# EAGLE schematic Sensor-amplification_V3 (EAGLE 7.4.0)
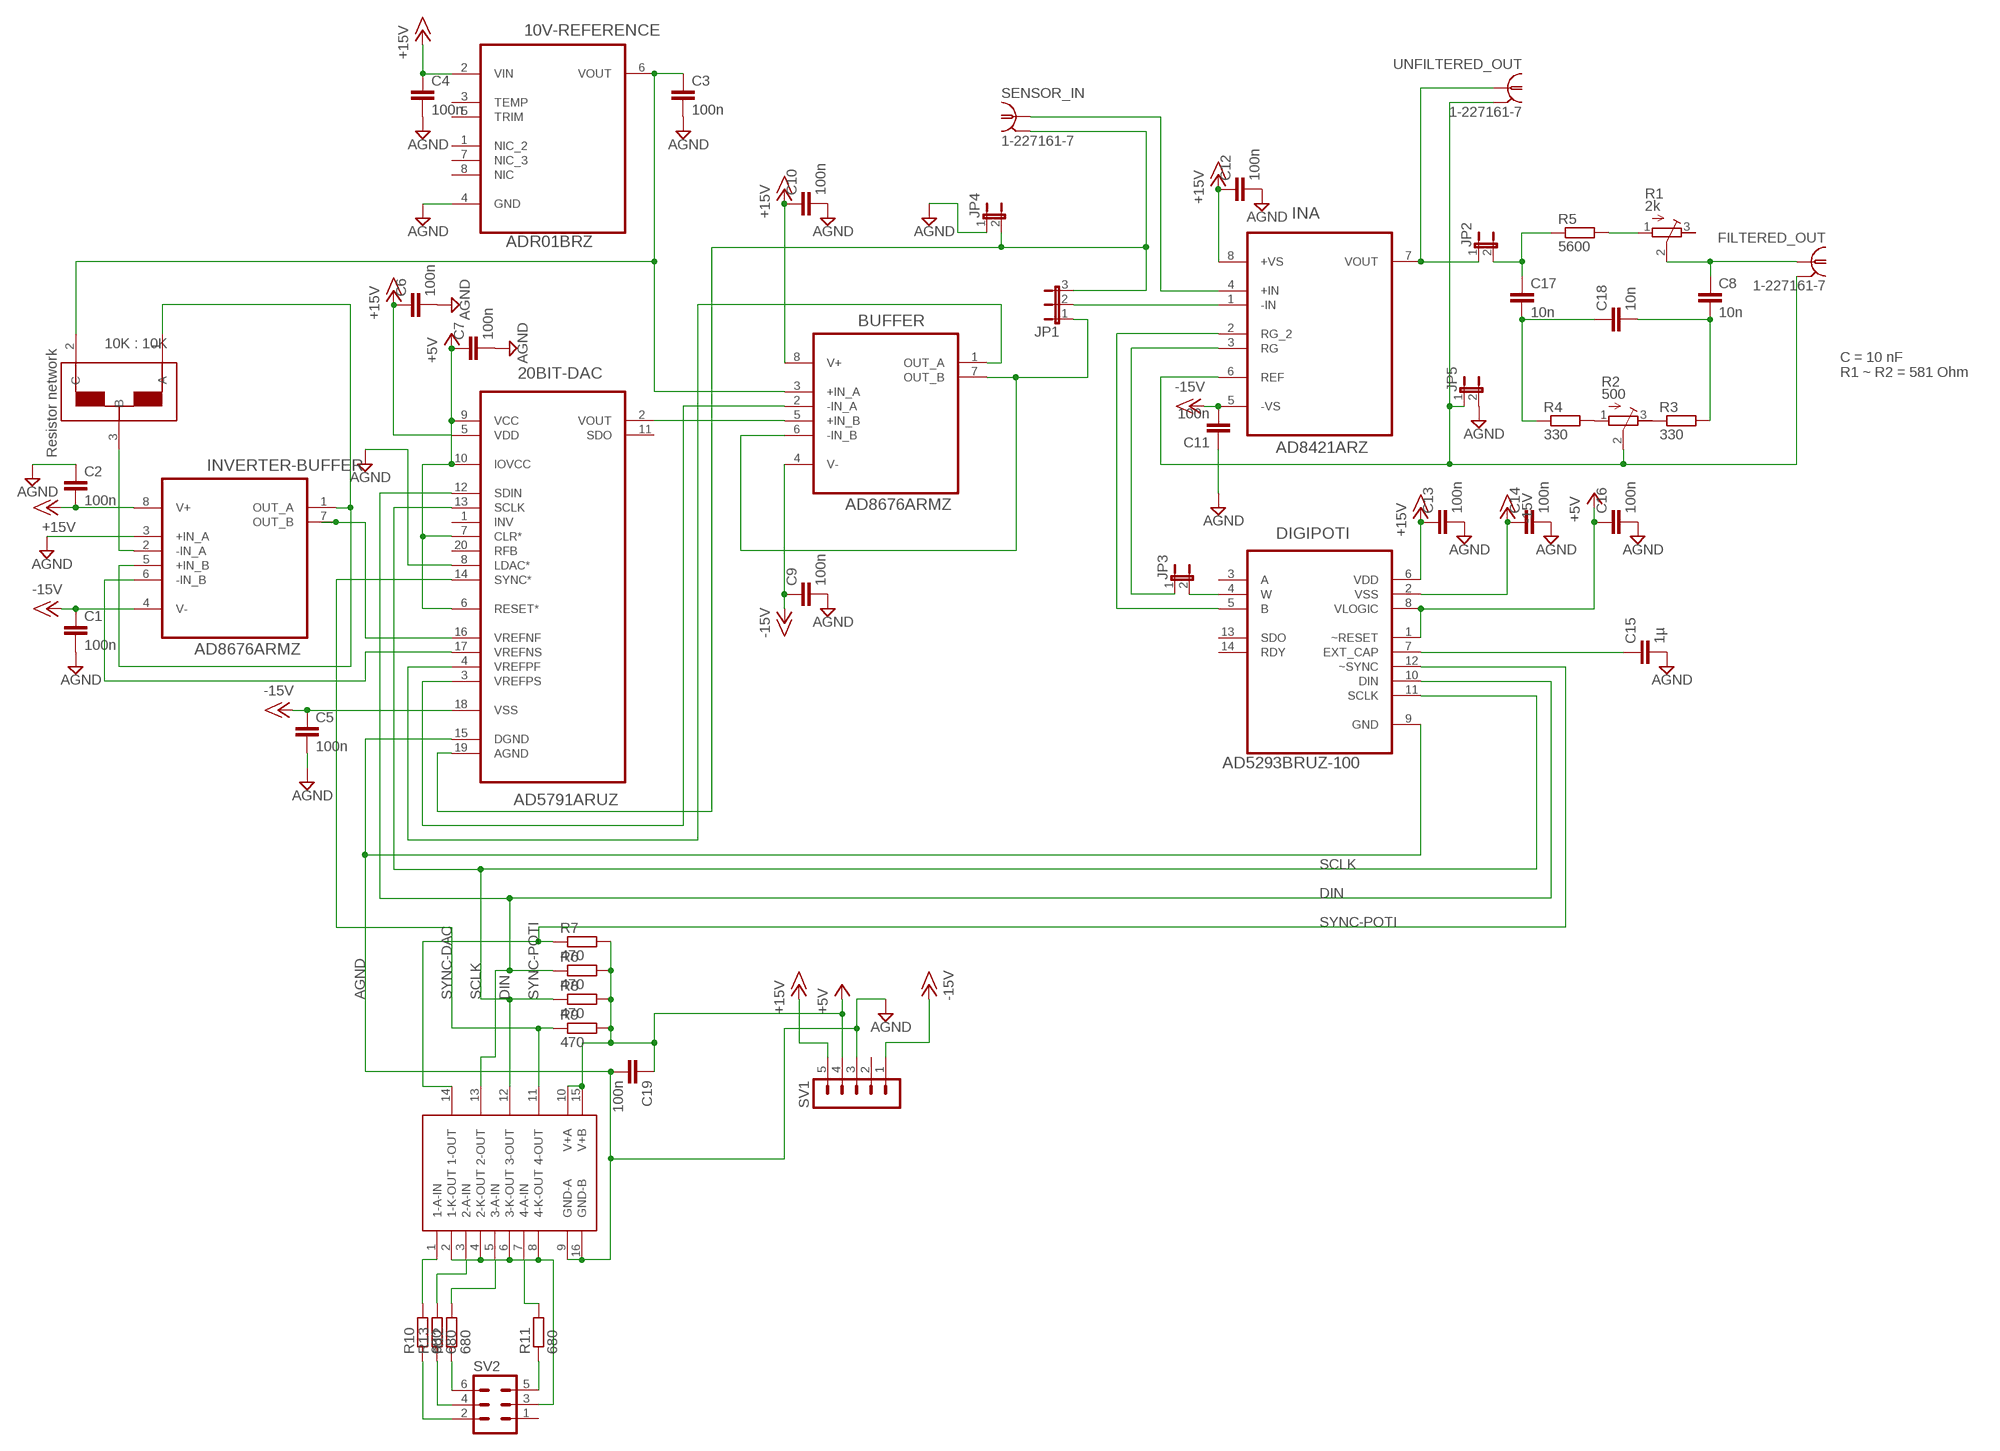
[diagram p0: schematic, sheet 1]

## Parts
10V-REFERENCE  ADR01BRZ  [SOIC127P600X175-8N]
20BIT-DAC  AD5791ARUZ  [SOP65P640X120-20N]
BUFFER  AD8676ARMZ  [SOP65P490X110-8N]
C1  100n  C-EUC0603  [C0603]
C2  100n  C-EUC0603  [C0603]
C3  100n  C-EUC0603  [C0603]
C4  100n  C-EUC0603  [C0603]
C5  100n  C-EUC0603  [C0603]
C6  100n  C-EUC0603  [C0603]
C7  100n  C-EUC0603  [C0603]
C8  10n  C-EUC0805  [C0805]
C9  100n  C-EUC0603  [C0603]
C10  100n  C-EUC0603  [C0603]
C11  100n  C-EUC0603  [C0603]
C12  100n  C-EUC0603  [C0603]
C13  100n  C-EUC0603  [C0603]
C14  100n  C-EUC0603  [C0603]
C15  1µ  C-EUC0603  [C0603]
C16  100n  C-EUC0603  [C0603]
C17  10n  C-EUC0805  [C0805]
C18  10n  C-EUC0805  [C0805]
C19  100n  C-EUC0603  [C0603]
DIGIPOTI  AD5293BRUZ-100  [SOP65P640X120-14N]
FILTERED_OUT  1-227161-7  [AMP_227161]
INA  AD8421ARZ  [SOIC127P600X175-8N]
INVERTER-BUFFER  AD8676ARMZ  [SOP65P490X110-8N]
JP1  JP2E  [JP2]
JP2  JP1E  [JP1]
JP3  JP1E  [JP1]
JP4  JP1E  [JP1]
JP5  JP1E  [JP1]
R1  2k  R-TRIMM64W  [RTRIM64W]
R2  500  R-TRIMM64W  [RTRIM64W]
R3  330  R-EU_M1206  [M1206]
R4  330  R-EU_M1206  [M1206]
R5  5600  R-EU_M1206  [M1206]
R6  470  R-EU_M1206  [M1206]
R7  470  R-EU_M1206  [M1206]
R8  470  R-EU_M1206  [M1206]
R9  470  R-EU_M1206  [M1206]
R10  680  R-EU_M1206  [M1206]
R11  680  R-EU_M1206  [M1206]
R12  680  R-EU_M1206  [M1206]
R13  680  R-EU_M1206  [M1206]
SENSOR_IN  1-227161-7  [AMP_227161]
SV1  MA05-1  [MA05-1]
SV2  MA03-2  [MA03-2]
U$1  MPMT2001AT5  [SOT23]
U$2  ACSL-6400  [SO16]
UNFILTERED_OUT  1-227161-7  [AMP_227161]

## Nets
+5V: 20BIT-DAC.6(RESET*) 20BIT-DAC.7(CLR*) 20BIT-DAC.9(VCC) 20BIT-DAC.10(IOVCC) C7.1 C16.1 C19.1 DIGIPOTI.1(~RESET) DIGIPOTI.8(VLOGIC) R6.2 R7.2 R8.2 R9.2 SV1.4 U$2.10(V+A) U$2.15(V+B)
+15V: 10V-REFERENCE.2(VIN) 20BIT-DAC.5(VDD) BUFFER.8(V+) C2.2 C4.1 C6.1 C10.1 C12.1 C13.1 DIGIPOTI.6(VDD) INA.8(+VS) INVERTER-BUFFER.8(V+) SV1.5
-15V: 20BIT-DAC.18(VSS) BUFFER.4(V-) C1.1 C5.1 C9.1 C11.2 C14.1 DIGIPOTI.2(VSS) INA.5(-VS) INVERTER-BUFFER.4(V-) SV1.1
AGND: 10V-REFERENCE.4(GND) 20BIT-DAC.8(LDAC*) 20BIT-DAC.15(DGND) C1.2 C2.1 C3.2 C4.2 C5.2 C6.2 C7.2 C9.2 C10.2 C11.1 C12.2 C13.2 C14.2 C15.2 C16.2 C19.2 DIGIPOTI.9(GND) INVERTER-BUFFER.3(+IN_A) JP4.1 JP5.2 SV1.3 U$2.9(GND-A) U$2.16(GND-B)
DIN: 20BIT-DAC.12(SDIN) DIGIPOTI.10(DIN) R6.1 U$2.13(2-OUT)
N$1: INA.7(VOUT) JP2.1 UNFILTERED_OUT.1
N$2: FILTERED_OUT.2 INA.6(REF) JP5.1 R2.2(S) UNFILTERED_OUT.2
N$3: INA.3(RG) JP3.1
N$4: DIGIPOTI.5(B) INA.2(RG_2)
N$5: INA.4(+IN) SENSOR_IN.1
N$6: 20BIT-DAC.19(AGND) JP1.3 JP4.2 SENSOR_IN.2
N$7: INA.1(-IN) JP1.2
N$8: DIGIPOTI.4(W) JP3.2
N$9: 10V-REFERENCE.6(VOUT) BUFFER.3(+IN_A) C3.1 U$1.2(C)
N$10: 20BIT-DAC.2(VOUT) BUFFER.5(+IN_B)
N$11: 20BIT-DAC.4(VREFPF) BUFFER.1(OUT_A)
N$12: 20BIT-DAC.3(VREFPS) BUFFER.2(-IN_A)
N$13: INVERTER-BUFFER.2(-IN_A) U$1.3(B)
N$14: 20BIT-DAC.16(VREFNF) INVERTER-BUFFER.7(OUT_B)
N$15: 20BIT-DAC.17(VREFNS) INVERTER-BUFFER.6(-IN_B)
N$16: INVERTER-BUFFER.1(OUT_A) INVERTER-BUFFER.5(+IN_B) U$1.1(A)
N$17: C15.1 DIGIPOTI.7(EXT_CAP)
N$18: C17.2 C18.1 R4.1
N$19: C8.2 C18.2 R3.2
N$20: C8.1 FILTERED_OUT.1 R1.2(S)
N$21: C17.1 JP2.2 R5.1
N$22: R2.3(E) R3.1
N$23: R2.1(A) R4.2
N$24: R1.1(A) R5.2
N$25: SV2.3 U$2.2(1-K-OUT) U$2.4(2-K-OUT) U$2.6(3-K-OUT) U$2.8(4-K-OUT)
N$26: R11.2 U$2.7(4-A-IN)
N$27: R12.2 U$2.5(3-A-IN)
N$28: R13.2 U$2.3(2-A-IN)
N$29: R10.1 SV2.2
N$30: R10.2 U$2.1(1-A-IN)
N$31: R13.1 SV2.4
N$32: R12.1 SV2.6
N$33: R11.1 SV2.5
SCLK: 20BIT-DAC.13(SCLK) DIGIPOTI.11(SCLK) R8.1 U$2.12(3-OUT)
SUBSTRACT_SELECT: BUFFER.6(-IN_B) BUFFER.7(OUT_B) JP1.1
SYNC-DAC: 20BIT-DAC.14(SYNC*) R9.1 U$2.11(4-OUT)
SYNC-POTI: DIGIPOTI.12(~SYNC) R7.1 U$2.14(1-OUT)
Unconnected: 10V-REFERENCE.1(NIC_2) 10V-REFERENCE.3(TEMP) 10V-REFERENCE.5(TRIM) 10V-REFERENCE.7(NIC_3) 10V-REFERENCE.8(NIC) 20BIT-DAC.1(INV) 20BIT-DAC.11(SDO) 20BIT-DAC.20(RFB) DIGIPOTI.3(A) DIGIPOTI.13(SDO) DIGIPOTI.14(RDY) R1.3(E) SV1.2 SV2.1

## Notes on the sheet
- 10K : 10K
- C = 10 nF
  R1 ~ R2 = 581 Ohm

## Library data of the parts
10V-REFERENCE = NaLi-specific:ADR01BRZ: Ultracompact, Precision 10.0 V/5.0 V/2.5 V/3.0 V Voltage References; MPN: ADR01BRZ; OC_FARNELL: 2305769; OC_NEWARK: 59K2657; PACKAGE: SOIC-8; SUPPLIER: Analog Devices
20BIT-DAC = NaLi-specific:AD5791ARUZ: Digital-to-Analog Converters; MPN: AD5791ARUZ; OC_FARNELL: 2074863; OC_NEWARK: 18T2142; PACKAGE: TSSOP-20; SUPPLIER: Analog Devices
BUFFER INVERTER-BUFFER = NaLi-specific:AD8676ARMZ: Dual Rail-to-Rail Output Op Amp; MPN: AD8676ARMZ; OC_FARNELL: 1776909; OC_NEWARK: 45P6471; PACKAGE: MSOP-8; SUPPLIER: ANALOG DEVICES
C1-C19 = resistor:C-EU: CAPACITOR, European symbol
DIGIPOTI = NaLi-specific:AD5293BRUZ-100: Digital Potentiometers; MPN: AD5293BRUZ-100; OC_FARNELL: -; OC_NEWARK: 52R8122; PACKAGE: TSSOP-14; SUPPLIER: Analog Devices
FILTERED_OUT SENSOR_IN UNFILTERED_OUT = con-coax:?227161*: JACK, RIGHT ANGLE, 50 OHM, PCB, BNC Source: amp_227161.pdf; MF: TYCO ELECTRONICS; MPN: 1-227161-7; OC_FARNELL: unknown; OC_NEWARK: 09H7855
INA = NaLi-specific:AD8421ARZ: Instrumentation Amplifier; MPN: AD8421ARZ; OC_FARNELL: 2126090; OC_NEWARK: 94T9482; PACKAGE: SOIC-8; SUPPLIER: Analog Devices
JP1 = jumper:JP2E: JUMPER
JP2-JP5 = jumper:JP1E: JUMPER
R1 R2 = resistor:R-TRIMM: Trimm resistor
R3-R13 = resistor:R-EU_: RESISTOR, European symbol
SV1 = con-lstb:MA05-1: PIN HEADER; OC_FARNELL: unknown; OC_NEWARK: unknown
SV2 = con-lstb:MA03-2: PIN HEADER; OC_FARNELL: unknown; OC_NEWARK: unknown
U$1 = NaLi-specific:MPMT2001AT5
U$2 = NaLi-specific:ACSL-6400